# Altium schematic sheet SCH-4.SchDoc
size A4; Date: 05.05.2020; Organization: Günsel Model 1 Body Harness; Revision: v0.1
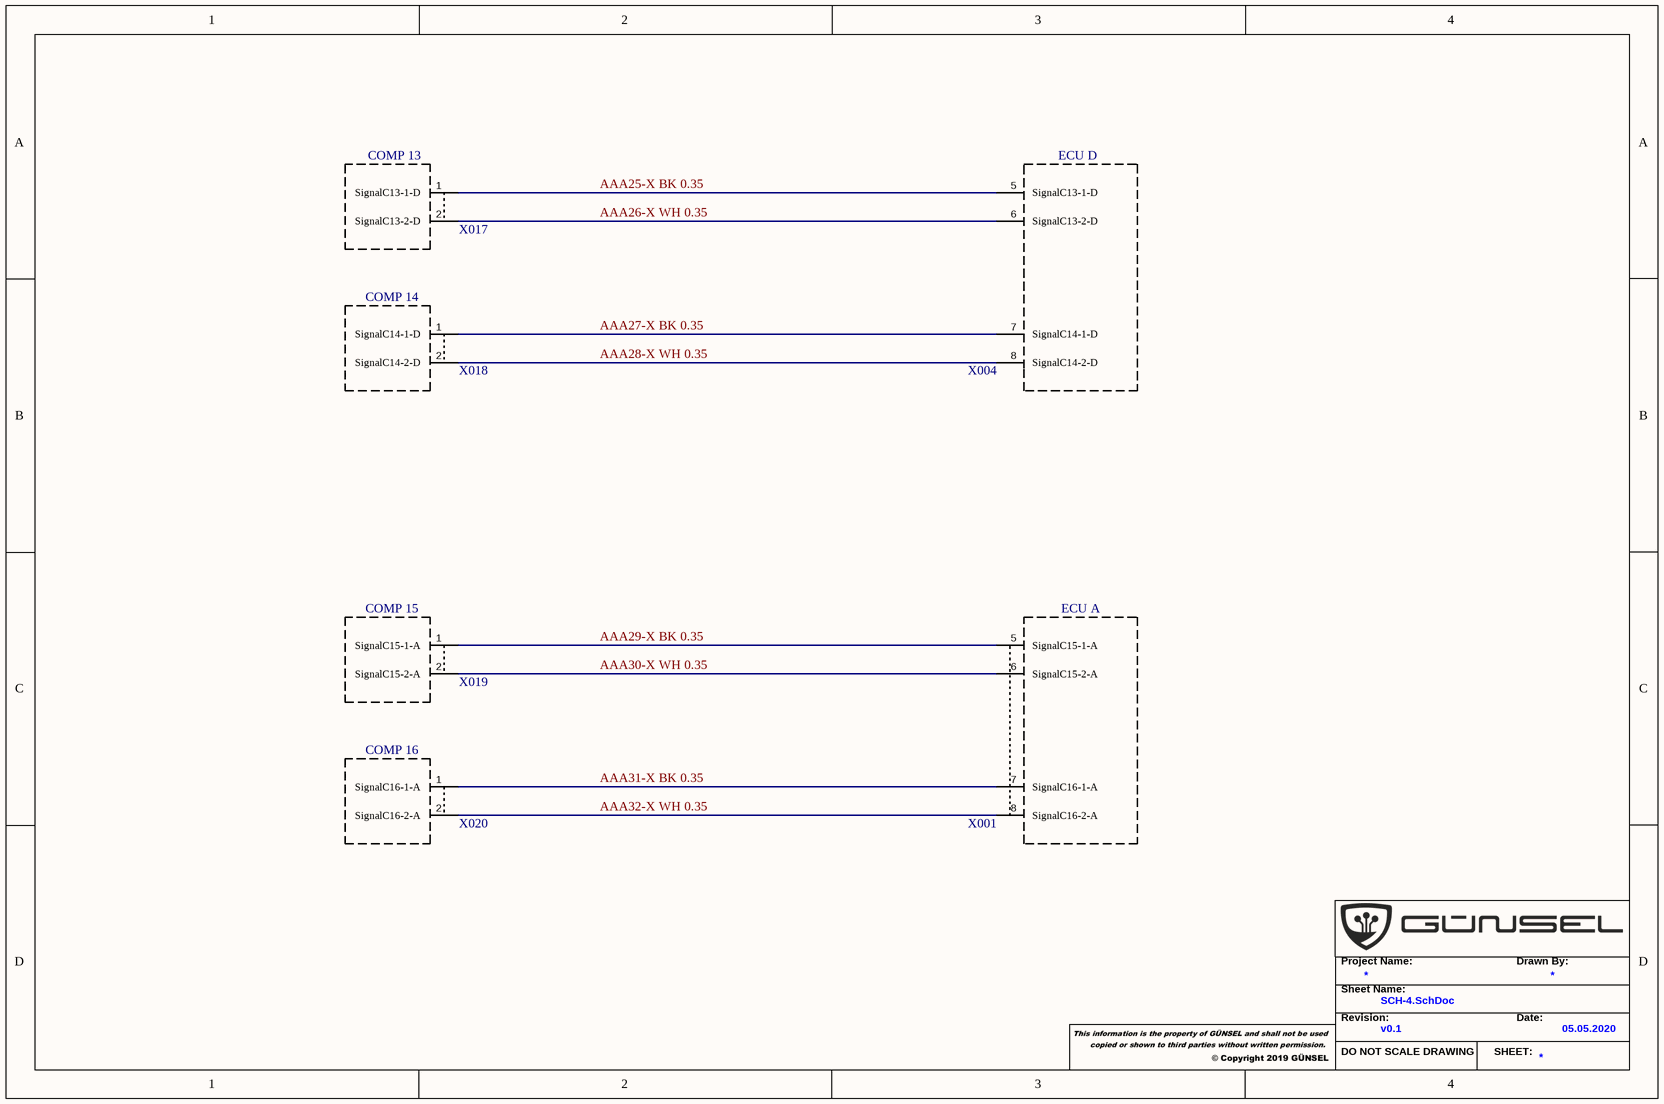
[diagram p0: SCH-4.SchDoc]

## Parts
X19  X004
X20  X017
X21  X018
X22  X001
X23  X019
X24  X020

## Blocks framed on the sheet
ECU A: X22

## Nets
AAA25-X BK 0.35: X19.5(SignalC13-1-D) X20.1(SignalC13-1-D)
AAA26-X WH 0.35: X19.6(SignalC13-2-D) X20.2(SignalC13-2-D)
AAA27-X BK 0.35: X19.7(SignalC14-1-D) X21.1(SignalC14-1-D)
AAA28-X WH 0.35: X19.8(SignalC14-2-D) X21.2(SignalC14-2-D)
AAA29-X BK 0.35: X22.5(SignalC15-1-A) X23.1(SignalC15-1-A)
AAA30-X WH 0.35: X22.6(SignalC15-2-A) X23.2(SignalC15-2-A)
AAA31-X BK 0.35: X22.7(SignalC16-1-A) X24.1(SignalC16-1-A)
AAA32-X WH 0.35: X22.8(SignalC16-2-A) X24.2(SignalC16-2-A)

Not connected (* = marked no-connect by the designer): X19 1 2 3 4 9 10 11 12 13 14 15 16 17 18 19 20; X20 3 4 5; X21 3 4 5; X22 1 2 3 4 9 10 11 12 13 14 15 16 17 18 19 20; X23 3 4 5; X24 3 4 5

## Notes on the sheet
- (near X20) COMP 13
- (near X19) ECU D
- (near X21) COMP 14
- (near X23) COMP 15
- (near X24) COMP 16
- Project Name:
- Drawn By:
- Sheet Name:
- Revision:
- DO NOT SCALE DRAWING
- SHEET:
- Date:

## Library data of the parts
X19 = ECU D: Designator_: X004; Pin count: 20; Manufacturer Part number: E-4
X20 = COMP 13: Designator_: X017; Pin count: 5; Manufacturer Part number: C-13
X21 = COMP 14: Designator_: X018; Pin count: 5; Manufacturer Part number: C-14
X22 = ECU A: Designator_: X001; Pin count: 20; Manufacturer Part number: E-1
X23 = COMP 15: Designator_: X019; Pin count: 5; Manufacturer Part number: C-15
X24 = COMP 16: Designator_: X020; Pin count: 5; Manufacturer Part number: C-16